# Altium schematic sheet Schematic_R2.5.SchDoc
size A2; CompanyName: OMNITECH ELECTRONICS INCORPORATED; Organization: Omnitech Electronics Inc.; Address1: 1-10 Akerley Blvd, Dartmouth, Nova Scotia, Canada B3B 1J4; Address2: (902) 468-5911, FAX (902) 468-5912; Address3: www.omnitechelectronics.ca; SheetTotal: 5; PageSetup: Record=PageOptions|CenterHorizontal=True|CenterVertical=True|PrintScale=0.67|XCorrection=1.00|YCorrection=1.00|PrintKind=1|BorderSize=5000000|LeftOffset=0|BottomOffset=0|Orientation=2|PaperLength=1000|PaperWidth=1000|Scale=100|PaperSource=15|PrintQuality=600|MediaType=1|DitherType=10|PaperKind=11x17|PrintScaleMode=1
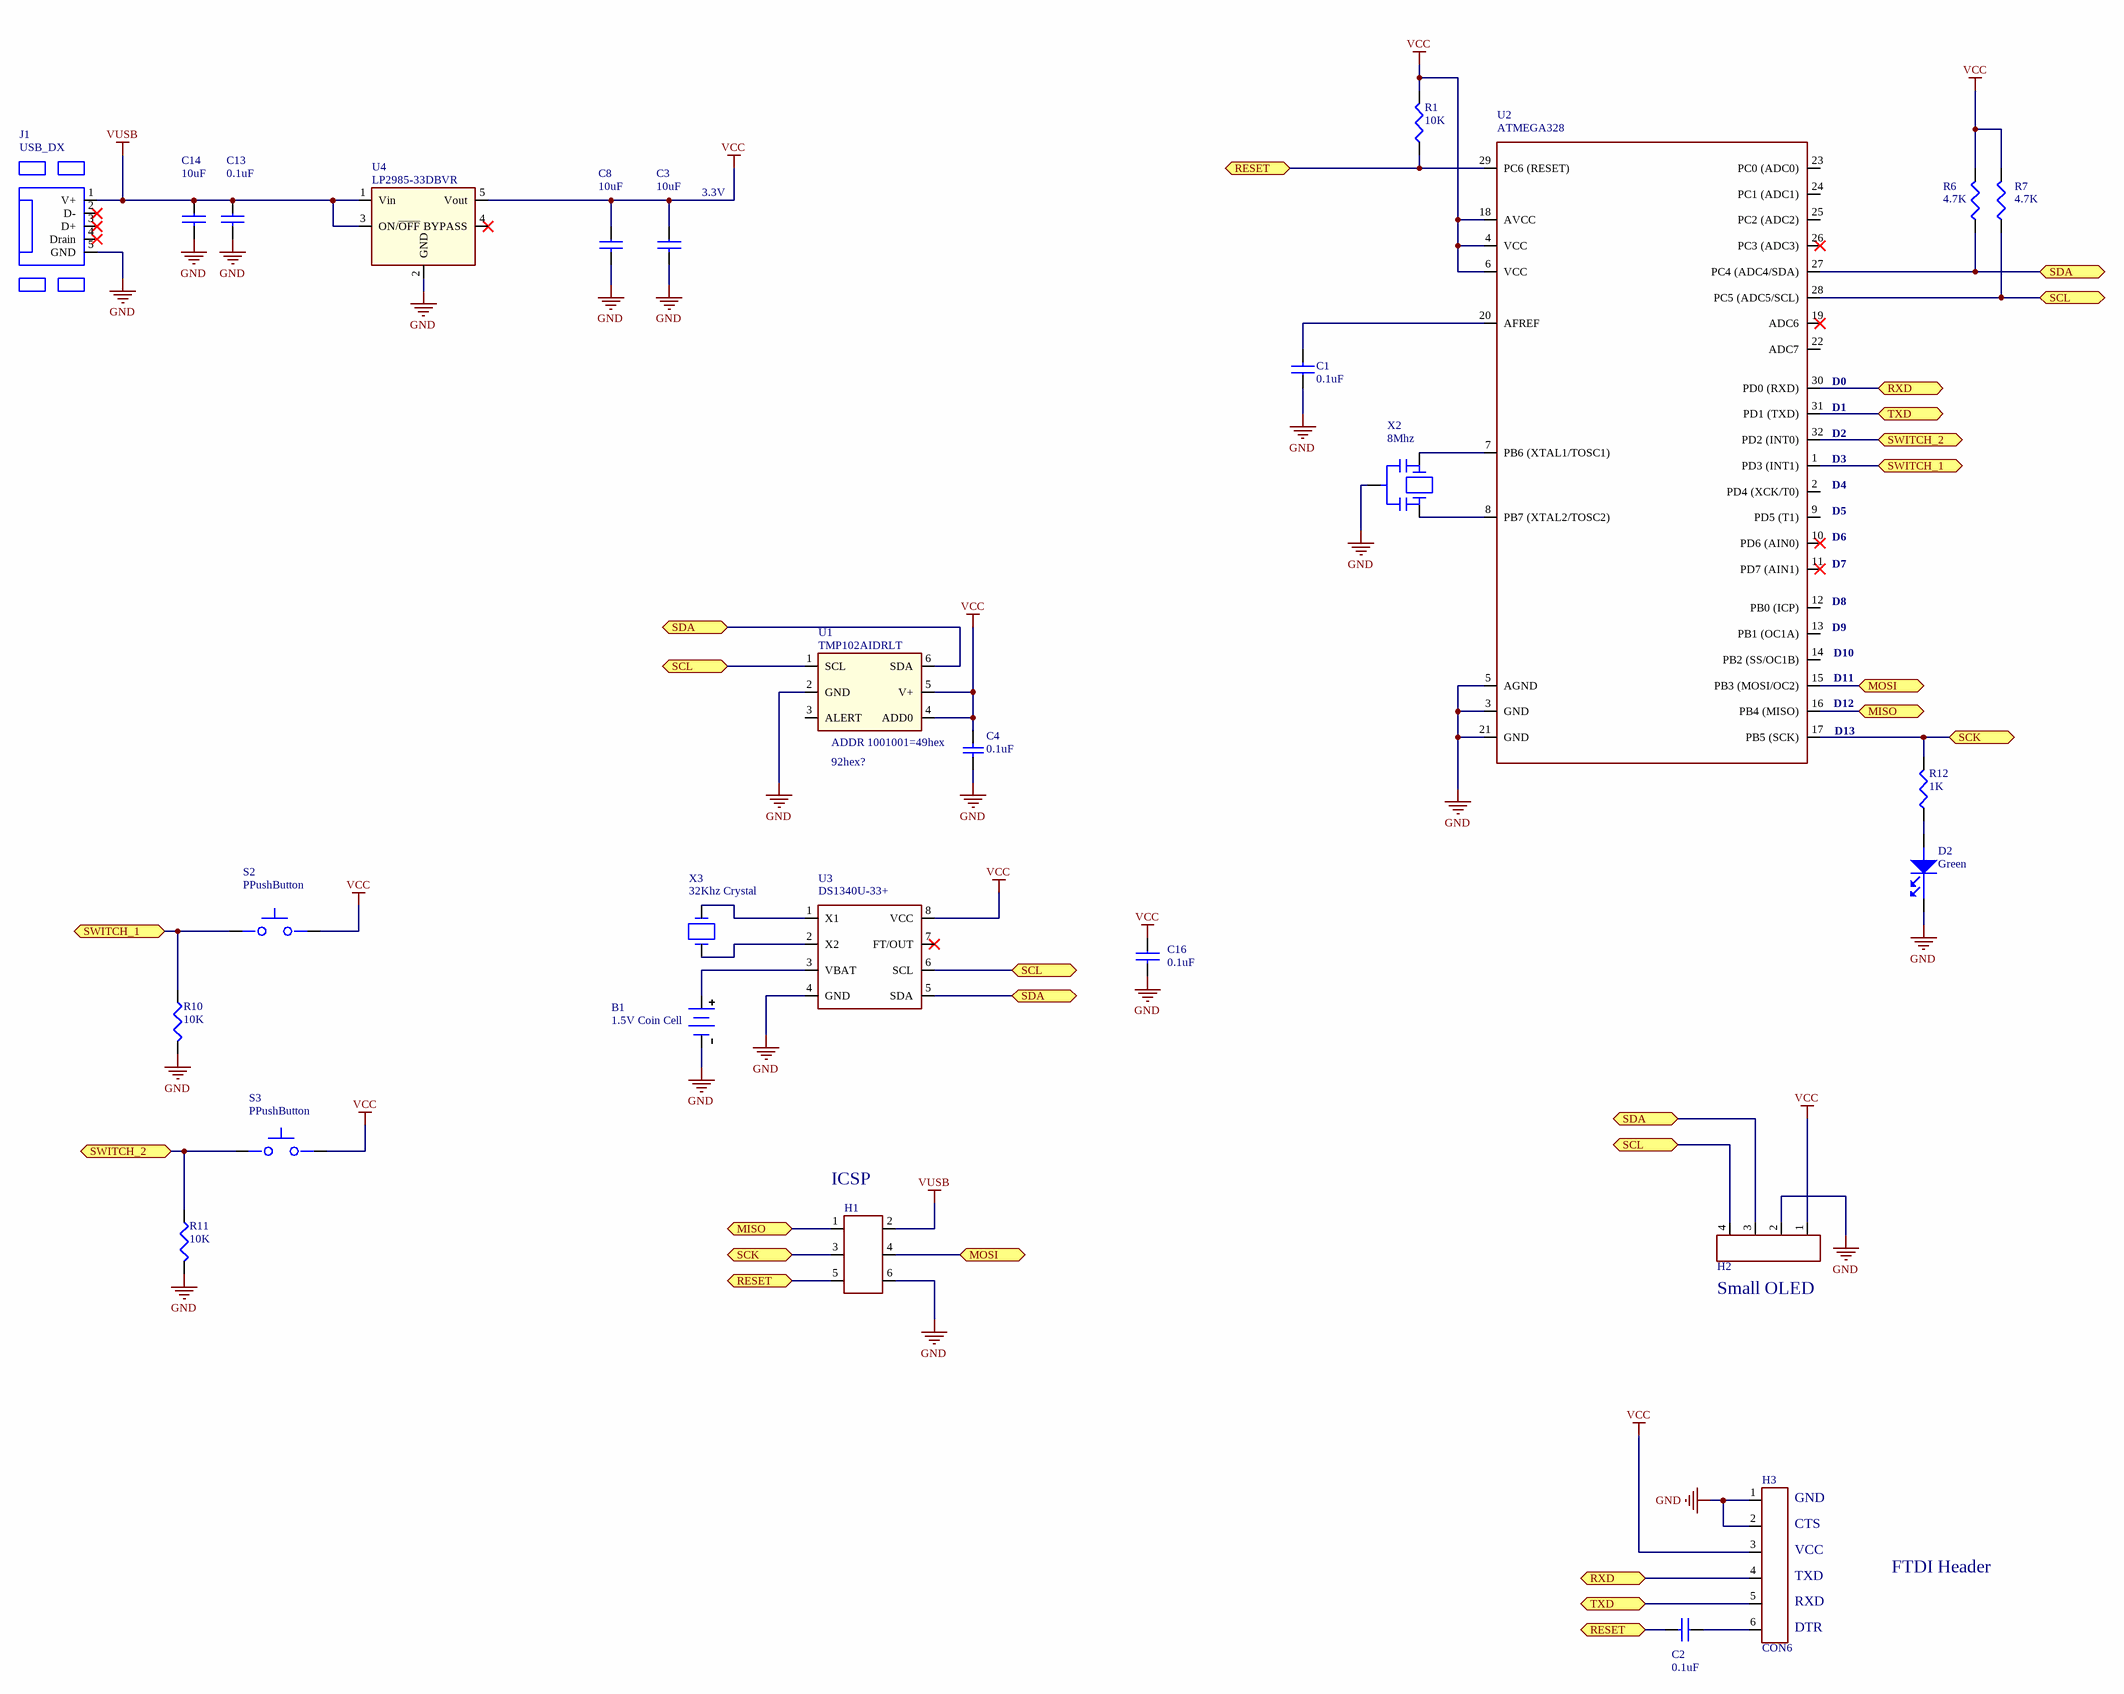
[diagram p0: Schematic_R2.5.SchDoc]

## Parts
B1  value 1.5V Coin Cell  [CR377 Mount]  (hidden comment: CR377)
C1  0.1uF  [CAPC1608X90N]
C2  0.1uF  [CAPC1608X90N]
C3  value 10uF  [CAPC3216X160N]
C4  0.1uF  [CAPC1608X09L]
C8  value 10uF  [CAPC3216X160N]
C13  0.1uF  [CAPC1608X90N]
C14  value 10uF  [CAPC3216X160N]
C16  0.1uF  [CAPC1608X90N]
D2  value Green  [LED1608X55N-YELLOW]  (hidden comment: LED_0603)
H1  CON3X2  [HDR3X2]  (value not drawn)
H2  TSW-104-07-L-S  [HDR1X4-Empty]  (value not drawn)
H3  CON6  [HDR1X6]
J1  USB_DX  [USB_DX]
R1  10K  [RESC1608X55N]
R6  4.7K  [RESC1608X55N]
R7  4.7K  [RESC1608X55N]
R10  10K  [RESC1608X55N]
R11  10K  [RESC1608X55N]
R12  1K  [RESC1608X55N]
S2  PPushButton  [SWITCH TACTILE RA- DX]
S3  PPushButton  [SWITCH TACTILE RA- DX]
U1  PartNumber: TMP102AIDRLT  [SOT50P150X130-6N]  (hidden comment: TMP102AIDRL)
U2  ATMEGA328  [TQFP80P700X700-32N]
U3  DS1340U-33+  [TSOP65P490X110-8N]
U4  LP2985-33DBVR  [SOT95P280X144-5N]
X2  8Mhz  [CSTCE]  (value not drawn)
X3  32Khz Crystal  [ECS-.327-12.5-34B]

## Ports
MISO (bidir), MOSI (bidir), RESET (bidir), RXD (bidir), SCK (bidir), SCL (bidir), SDA (bidir), SWITCH_1, SWITCH_2, TXD (bidir)

## Nets
GND: B1.2(-) C1.1 C3.2 C4.1 C8.2 C13.2 C14.2 C16.2 D2.1(CATHODE) H1.6 H2.2 H3.1 H3.2 J1.5(GND) R10.2 R11.2 U1.2(GND) U2.3(GND) U2.5(AGND) U2.21(GND) U3.4(GND) U4.2(GND) X2.2
VCC: C3.1 C4.2 C8.1 C16.1 H2.1 H3.3 R1.2 R6.2 R7.2 S2.2(B) S3.1(A) U1.4(ADD0) U1.5(V+) U2.4(VCC) U2.6(VCC) U2.18(AVCC) U3.8(VCC) U4.5(Vout)
VUSB: C13.1 C14.1 H1.2 J1.1(V+) U4.1(Vin) U4.3(ON/~{OFF})
MISO: H1.1 U2.16(PB4_(MISO)) ; port MISO
MOSI: H1.4 U2.15(PB3_(MOSI/OC2)) ; port MOSI
RESET: C2.2 H1.5 R1.1 U2.29(PC6_(RESET)) ; port RESET
RXD: H3.4 U2.30(PD0_(RXD)) ; port RXD
SCK: H1.3 R12.2 U2.17(PB5_(SCK)) ; port SCK
SCL: H2.4 R7.1 U1.1(SCL) U2.28(PC5_(ADC5/SCL)) U3.6(SCL) ; port SCL
SDA: H2.3 R6.1 U1.6(SDA) U2.27(PC4_(ADC4/SDA)) U3.5(SDA) ; port SDA
SWITCH_1: R10.1 S2.1(A) U2.1(PD3_(INT1)) ; port SWITCH_1
SWITCH_2: R11.1 S3.2(B) U2.32(PD2_(INT0)) ; port SWITCH_2
TXD: H3.5 U2.31(PD1_(TXD)) ; port TXD
NetB1_1: B1.1(+) U3.3(VBAT)
NetC1_2: C1.2 U2.20(AFREF)
NetC2_1: C2.1 H3.6
NetD2_2: D2.2(ANODE) R12.1
NetU2_7: U2.7(PB6_(XTAL1/TOSC1)) X2.1
NetU2_8: U2.8(PB7_(XTAL2/TOSC2)) X2.3
NetU3_1: U3.1(X1) X3.1
NetU3_2: U3.2(X2) X3.2

Not connected (* = marked no-connect by the designer): J1 2(D-)* 3(D+)* 4(Drain)*; U1 3(ALERT); U2 2(PD4_(XCK/T0)) 9(PD5_(T1)) 10(PD6_(AIN0))* 11(PD7_(AIN1))* 12(PB0_(ICP)) 13(PB1_(OC1A)) 14(PB2_(SS/OC1B)) 19(ADC6)* 22(ADC7) 23(PC0_(ADC0)) 24(PC1_(ADC1)) 25(PC2_(ADC2)) 26(PC3_(ADC3))*; U3 7(FT/OUT)*; U4 4(BYPASS)*

## Notes on the sheet
- (near C3) 3.3V
- (near U2) D1
- (near U2) D0
- (near X2) 8Mhz
- (near U2) D4
- (near U2) D3
- (near U2) D2
- (near U2) D6
- (near U2) D5
- (near U2) D8
- (near U2) D7
- (near U2) D9
- (near U2) D11
- (near U2) D10
- (near U1) ADDR 1001001=49hex
- (near U2) D12
- (near U2) D13
- (near U1) 92hex?
- (near H1) ICSP
- (near H2) Small OLED
- (near H3) GND
- (near H3) CTS
- (near H3) VCC
- (near H3) TXD
- FTDI Header
- (near H3) RXD
- (near H3) DTR

## Library data of the parts
B1 = CR377: Custom CR377 mount; Manufacturer: Sunbeam; Vendor: DX
C1 C2 = CAP_0603: CAP CER 0.1uF, 0603; Value: 0.1uF
C3 C8 C14 = CAP_1206
C4 = Cap Semi: CAP CER 0.1UF 50V 10% X7R 0603; PartNumber: GRM188R71H104KA93D; Manufacturer: Murata; Vendor: Digikey; Value: 0.1uF
C13 = CAP_0603: CAP 0603; Value: 0.1uF
C16 = CAP_0603: CAP CER 0.1uF 0603; Value: 0.1uF
H1 = CON3X2: CONN HEADER 3X2POS .100" PADS; PartNumber: PADS
H2 = TSW-104-07-L-S: CONN HEADER 4POS .100" SGL GOLD; Available From: Samtec; Data Sheet: http://www.samtec.com/ProductInformation/TechnicalSpecifications/Overview.aspx?series=TSW; Exact Part Number: TSW-104-07-L-S; Manufacturer: Samtec; Operating Temp: *; Order Part Number: TSW-104-07-L-S; Price: $0.64; ROHS Compliant: Yes; Voltage/Pwr: *
H3 = CON6: CONN HEADER 6POS .100" PADS; PartNumber: PADS
J1 = USB_DX: CONN RECEPT MINIUSB R/A 5POS SMD; Vendor: Digikey; PartNumber: USB_DX; Value: USB_DX
R1 R6 R7 = RES_0603: RES 10K, 0603
  R1: Value: 10K
  R6 R7: Value: 4.7K
R10 R11 = RES_0603: RES 10K 0603; Value: 10K
R12 = RES_0603: RES 330R, 0603; Value: 1K
S2 S3 = DX_MINI_TACT_SWITCH_RA: Value: Mini Tactile Switch RA
U1 = TMP102AIDRL: IC DGTL TEMP SENSOR LP SOT-563; Manufacturer: Texas Instruments; Vendor: Digikey
U2 = ATMEGA328-AUR: MCU AVR 32K FLASH 32TQFP; PartNumber: ATMEGA328P-AU-ND; Manufacturer: Atmel; Value: ATMEGA328P-AU-ND
U3 = DS1340U-33+: IC RTC SERIAL 512K 8-TSSOP; Manufacturer: Maxim; Vendor: Digikey; PartNumber: DS1340U-33+; Value: DS1340U-33+
U4 = LP2985-33DBVR: IC REG LDO 3.3V .15A SOT23-5; Manufacturer: Texas Instruments; Vendor: Digikey; PartNumber: LP2985-33DBVR
X2 = CSTCE8M00G55-R0: CER RESONATOR 8.0MHZ SMD; Manufacturer: Murata; Vendor: Digikey; PartNumber: CSTCE8M00G55-R0; Value: 8Mhz
X3 = ECS-.327-12.5-34B: CRYSTAL 32.768 KHZ 12.5PF SMD; Manufacturer: ECS; PartNumber: ECS-.327-12.5-34B